# Altium schematic sheet Connectors.SchDoc
size A; SheetNumber: 13
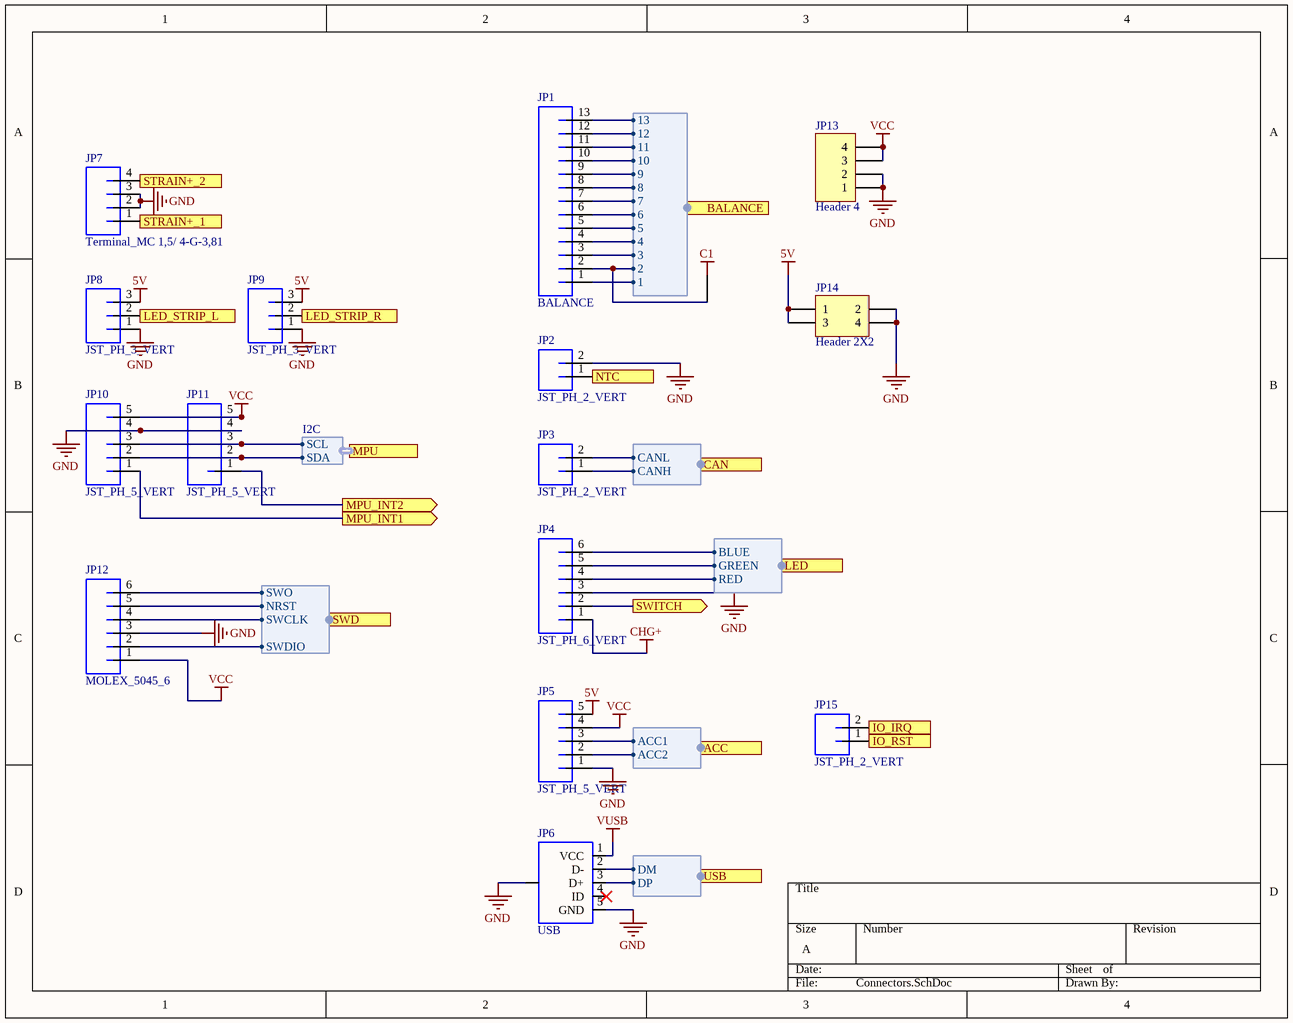
[diagram p0: Connectors.SchDoc]

## Parts
*1  NetTie  [NetTie]  (value not drawn)  (net tie, no BOM)
JP1  BALANCE  [JST-XH-13-PTH-VERT]
JP2  JST_PH_2_VERT  [JST-PH-2-PTH-VERT]
JP3  JST_PH_2_VERT  [JST-PH-2-PTH-VERT]
JP4  JST_PH_6_VERT  [JST-PH-6-PTH-VERT]
JP5  JST_PH_5_VERT  [JST-PH-5-PTH-VERT]
JP6  USB  [USB-MICROB_HORZ]
JP7  Terminal_MC 1,5/ 4-G-3,81  [Terminal-3.81-HORZ]
JP8  JST_PH_3_VERT  [JST-PH-3-PTH-VERT]
JP9  JST_PH_3_VERT  [JST-PH-3-PTH-VERT]
JP10  JST_PH_5_VERT  [JST-PH-5-PTH-VERT]
JP11  JST_PH_5_VERT  [JST-PH-5-PTH-VERT]
JP12  MOLEX_5045_6  [MOLEX_5045_6]
JP13  Header 4  [HDR1X4]
JP14  Header 2X2  [HDR2X2]
JP15  JST_PH_2_VERT  [JST-PH-2-PTH-VERT]

## Ports
ACC (harness Accessory Outputs), BALANCE (harness Balance), CAN (harness CAN Output), IO_IRQ (out), IO_RST (in), LED (harness LED), LED_STRIP_L (in), LED_STRIP_R (in), MPU (harness I2C), MPU_INT1 (out), MPU_INT2 (out), NTC (in), STRAIN+_1 (in), STRAIN+_2 (in), SWD (harness SWD), SWITCH (out), USB (harness USB)

## Harnesses
USB: DM, DP
Accessory Outputs: ACC1, ACC2
CAN Output: CANL, CANH
Balance: 13, 12, 11, 10, 9, 8, 6, 7, 5, 3, 4, 2, 1
I2C: SCL, SDA
SWD: SWCLK, SWDIO, SWO, NRST
LED: RED, BLUE, GREEN

## Nets
5V: JP5.5 JP8.3 JP9.3 JP14.1 JP14.3
C1: *1.2
CHG+: JP4.1
GND: JP2.2 JP4.3 JP5.1 JP6.5(GND) JP6.6(SHIELD) JP7.2 JP7.3 JP8.1 JP9.1 JP10.4 JP11.4 JP12.3 JP13.1 JP13.2 JP14.2 JP14.4
VCC: JP5.4 JP10.5 JP11.5 JP12.1 JP13.3 JP13.4
VUSB: JP6.1(VCC)
IO_IRQ: JP15.2 ; port IO_IRQ
IO_RST: JP15.1 ; port IO_RST
LED_STRIP_L: JP8.2 ; port LED_STRIP_L
LED_STRIP_R: JP9.2 ; port LED_STRIP_R
MPU_INT1: JP10.1 ; port MPU_INT1
MPU_INT2: JP11.1 ; port MPU_INT2
NTC: JP2.1 ; port NTC
STRAIN+_1: JP7.1 ; port STRAIN+_1
STRAIN+_2: JP7.4 ; port STRAIN+_2
SWITCH: JP4.2 ; port SWITCH
Net*1_1: *1.1 JP1.2 ; port BALANCE.2
NetJP1_1: JP1.1 ; port BALANCE.1
NetJP1_3: JP1.3 ; port BALANCE.3
NetJP1_4: JP1.4 ; port BALANCE.4
NetJP1_5: JP1.5 ; port BALANCE.5
NetJP1_6: JP1.6 ; port BALANCE.6
NetJP1_7: JP1.7 ; port BALANCE.7
NetJP1_8: JP1.8 ; port BALANCE.8
NetJP1_9: JP1.9 ; port BALANCE.9
NetJP1_10: JP1.10 ; port BALANCE.10
NetJP1_11: JP1.11 ; port BALANCE.11
NetJP1_12: JP1.12 ; port BALANCE.12
NetJP1_13: JP1.13 ; port BALANCE.13
NetJP3_1: JP3.1 ; port CAN.CANH
NetJP3_2: JP3.2 ; port CAN.CANL
NetJP4_4: JP4.4 ; port LED.RED
NetJP4_5: JP4.5 ; port LED.GREEN
NetJP4_6: JP4.6 ; port LED.BLUE
NetJP5_2: JP5.2 ; port ACC.ACC2
NetJP5_3: JP5.3 ; port ACC.ACC1
NetJP6_2: JP6.2(D-) ; port USB.DM
NetJP6_3: JP6.3(D+) ; port USB.DP
NetJP10_2: JP10.2 JP11.2 ; port MPU.SDA
NetJP10_3: JP10.3 JP11.3 ; port MPU.SCL
NetJP12_2: JP12.2 ; port SWD.SWDIO
NetJP12_4: JP12.4 ; port SWD.SWCLK
NetJP12_5: JP12.5 ; port SWD.NRST
NetJP12_6: JP12.6 ; port SWD.SWO

Not connected (* = marked no-connect by the designer): JP6 4(ID)*

## Library data of the parts
JP1 = JST_XH_13_VERT: Manufacturer: JST Sales America, Inc.; PartNumber: B13B-XH-A(LF)(SN); Mounting Technology: Through Hole; PackageReference: JST-XH
JP2 JP3 JP15 = JST_PH_2_VERT: Manufacturer: JST Sales America Inc.; PartNumber: B2B-PH-K-S(LF)(SN); Mounting Technology: Through Hole; PackageReference: JST-PH
JP4 = JST_PH_6_VERT: PartNumber: B6B-PH-K-S(LF)(SN); Manufacturer: JST Sales America Inc.; PackageReference: JST-PH; Mounting Technology: Through Hole
JP5 JP10 JP11 = JST_PH_5_VERT: Manufacturer: JST Sales America, Inc.; PartNumber: B5B-PH-K-S(LF)(SN); PackageReference: JST-PH; Mounting Technology: Through Hole
JP6 = USB_MICROB_SMT: pin to pad: 1>VBUS 2>D- 3>D+ 4>ID 5>GND 6>MT1+P$1+P$2+MT2; PartNumber: 10118192-0001LF; Manufacturer: Amphenol FCI; Mounting Technology: Surface Mount; PackageReference: USB - Micro B
JP7 = Terminal_MC 1,5/ 4-G-3,81: PartNumber: 1803293; Manufacturer: Phoenix Contact; MatePart: 1803594; PackageReference: MC; Mounting Technology: Through Hole
JP8 JP9 = JST_PH_3_VERT: Manufacturer: JST Sales America Inc.; PartNumber: B3B-PH-K-S(LF)(SN); Mounting Technology: Through Hole; PackageReference: JST-PH
JP12 = MOLEX_5045_6: PartNumber: B6B-PH-K-S(LF)(SN); Manufacturer: JST Sales America Inc.; PackageReference: JST-PH; Mounting Technology: Through Hole
JP13 = Header 4: Header, 4-Pin; LatestRevisionDate: 17-Jul-2002; LatestRevisionNote: Re-released for DXP Platform.; Publisher: Altium Limited
JP14 = Header 2X2: Header, 2-Pin, Dual row; LatestRevisionDate: 17-Jul-2002; LatestRevisionNote: Re-released for DXP Platform.; Publisher: Altium Limited